# EAGLE design TransformerBox (EAGLE 9.7.0)
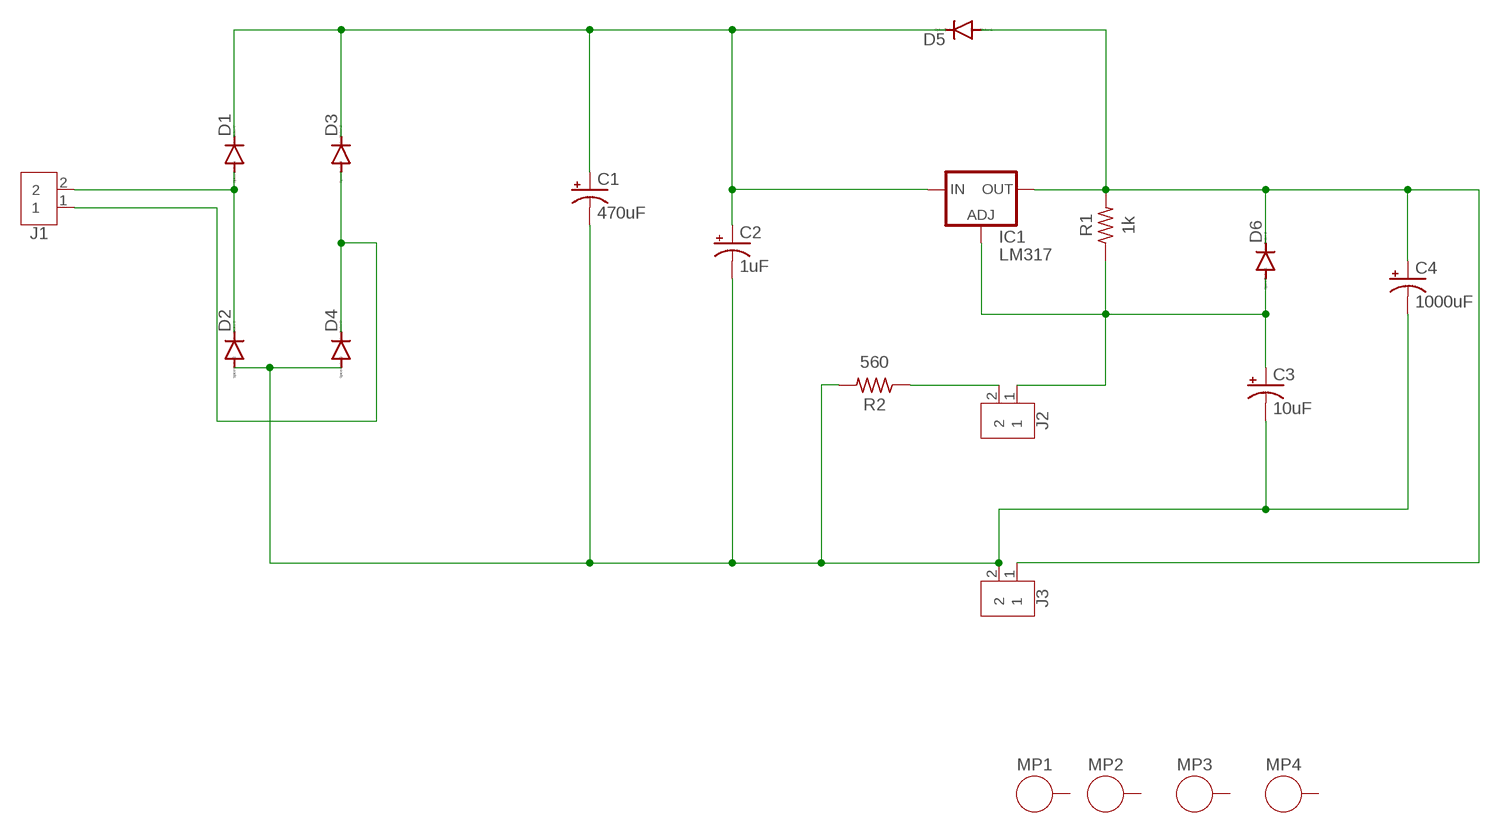
[diagram p0: schematic, sheet 1]

## Parts
C1  470uF  CAP-POL3.5MM  [E3,5-8]
C2  1uF  CAP-POL3.5MM  [E3,5-8]
C3  10uF  CAP-POL3.5MM  [E3,5-8]
C4  1000uF  CAP-POL3.5MM  [E3,5-8]
D1  DIODEDO35-10  [DO35-10]
D2  DIODEDO35-10  [DO35-10]
D3  DIODEDO35-10  [DO35-10]
D4  DIODEDO35-10  [DO35-10]
D5  DIODEDO35-10  [DO35-10]
D6  DIODEDO35-10  [DO35-10]
IC1  LM317  [TO220V]
J1  TERM-BLK-2P  TERMBLK_25.08MM  [TERMBLK_508-2N]
J2  TERM-BLK-2P  TERMBLK_25.08MM  [TERMBLK_508-2N]
J3  TERM-BLK-2P  TERMBLK_25.08MM  [TERMBLK_508-2N]
MP1  STANDOFF_M/F_M2_5MM  [STANDOFF_HEX_MALE-FEMALE_400X500_M2X0.4_MTGP600H220]
MP2  STANDOFF_M/F_M2_5MM  [STANDOFF_HEX_MALE-FEMALE_400X500_M2X0.4_MTGP600H220]
MP3  STANDOFF_M/F_M2_5MM  [STANDOFF_HEX_MALE-FEMALE_400X500_M2X0.4_MTGP600H220]
MP4  STANDOFF_M/F_M2_5MM  [STANDOFF_HEX_MALE-FEMALE_400X500_M2X0.4_MTGP600H220]
R1  1k  RESISTOR_AXIAL-11.7MM-PITCH  [RESAD1176W63L850D250B]
R2  560  RESISTOR_AXIAL-11.7MM-PITCH  [RESAD1176W63L850D250B]

## Nets
N$1: D1.A D2.C J1.2
N$2: D3.A D4.C J1.1
N$3: C1.- C2.- C3.- C4.- D2.A D4.A J3.2 R2.2
N$4: C1.+ C2.+ D1.C D3.C D5.C IC1.3(IN)
N$5: J2.2 R2.1
N$6: C4.+ D5.A D6.C IC1.2(OUT) J3.1 R1.2
N$7: C3.+ D6.A IC1.1(ADJ) J2.1 R1.1
Unconnected: MP1.1 MP2.1 MP3.1 MP4.1

## Library data of the parts
C1-C4 = SEMET 1:CAP-POL: POLARIZED CAPACITOR
D1-D6 = SEMET 1:DIODE: DIODE high speed (Philips)
IC1 = SEMET 1:LM317: VOLTAGE REGULATOR
J1-J3 = SEMET 1:TERMBLK_2: 2 Position Wire to Board Terminal Block Horizontal with Board Datasheet <https://www.te.com.cn/commerce/DocumentDelivery/DDEController?Action=showdoc&DocId=Catalog+Section%7F1308389_EUROSTYLE_TERMINAL_BLOCKS%7F0607%7Fpdf%7FEnglish%7FENG_CS_1308389_EUROSTYLE_TERMINAL_BLOCKS_0607.pdf%7F2-282837-5>; CATEGORY: Fixed Terminal Blocks; DESCRIPTION: Fixed Terminal Blocks 5.08MM PCB MOUNT 2P; MANUFACTURER: TE Connectivity AMP Connectors; MPN: 282837-2; OPERATING_TEMPERATURE: -40°C to +105°C; PART_STATUS: ACTIVE; PITCH: 0.200" (5.08mm); ROHS_COMPLIANCE: RoHS Compliant; SERIES: Buchanan; SUBCATEGORY: Terminal Blocks; TYPE: Through Hole; Screw - Rising Cage Clamp; Side wire entry, Horizontal with Board
MP1-MP4 = PCB-Fasteners_Hardware:STANDOFF_M/F: Male-Male Standoff/Spacer with Mounting pad and hole. Essentra : Male-Female Standoff <https://www.essentracomponents.co.in/index.php?option=com_virtuemart&view=productdetails&virtuemart_product_id=14556> The hole and pad sizes may vary based on the application and type of hardware; always verify the Manufacturer specification or Global Standards.; CATEGORY: Standoff/Spacer; DESCRIPTION: Hex Standoff Threaded M2 5 mm; HEIGHT: 5 mm; PACKAGE_SIZE: NA; PACKAGE_TYPE: NA; SUBCATEGORY: Male-Female; THREADED: Threaded; THREAD_SIZE: M2; TYPE: Hex Standoff
R1 R2 = SEMET 1:RESISTOR: Resistor Fixed - ANSI; CATEGORY: Resistor; SUB-CATEGORY: Fixed

## Board
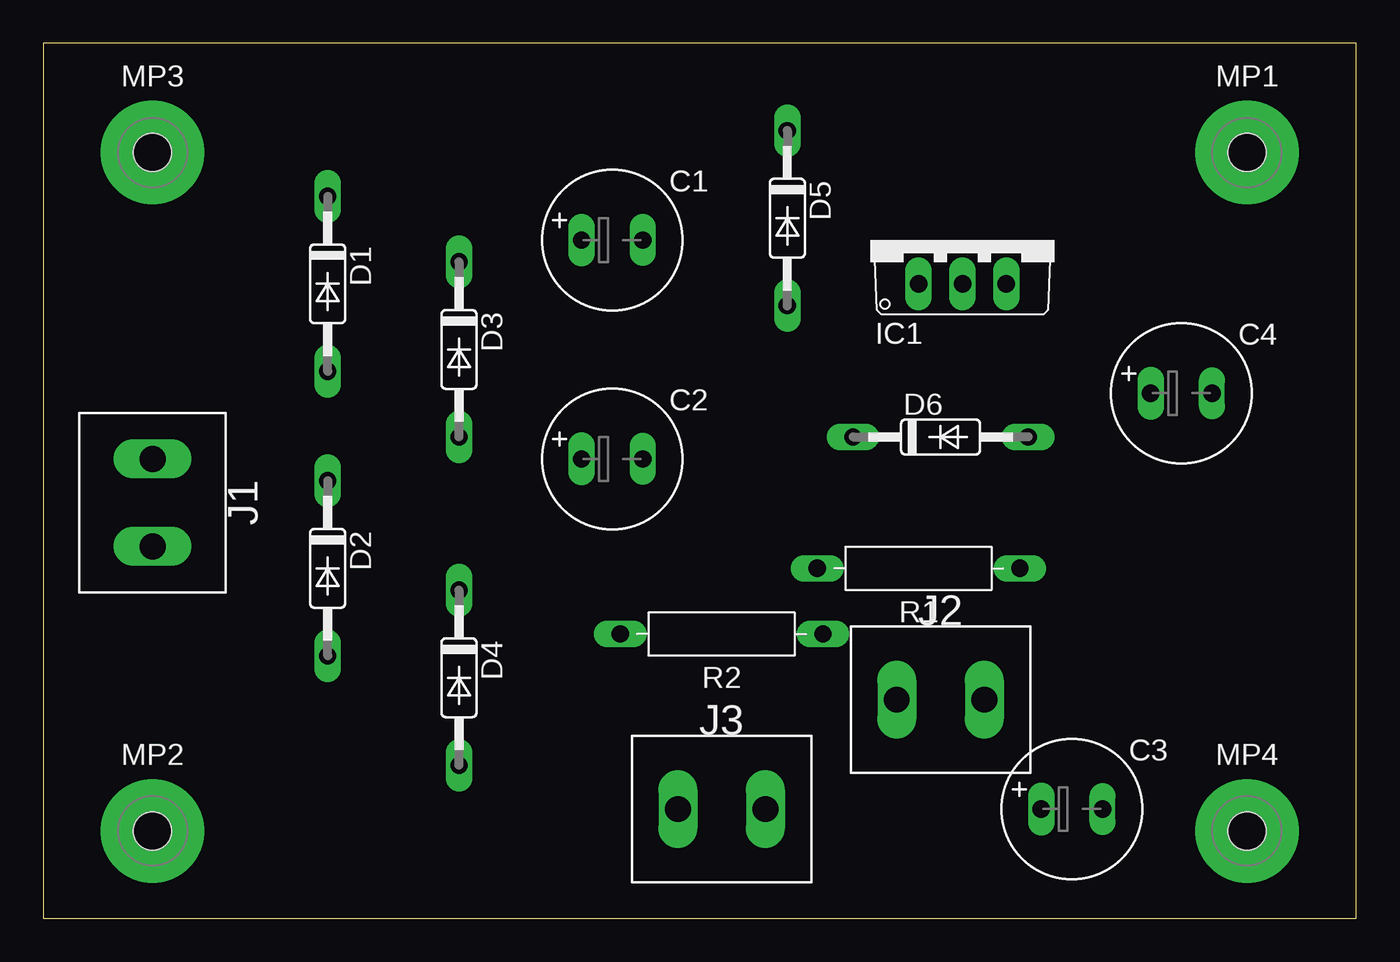
[diagram p1: board, top side]
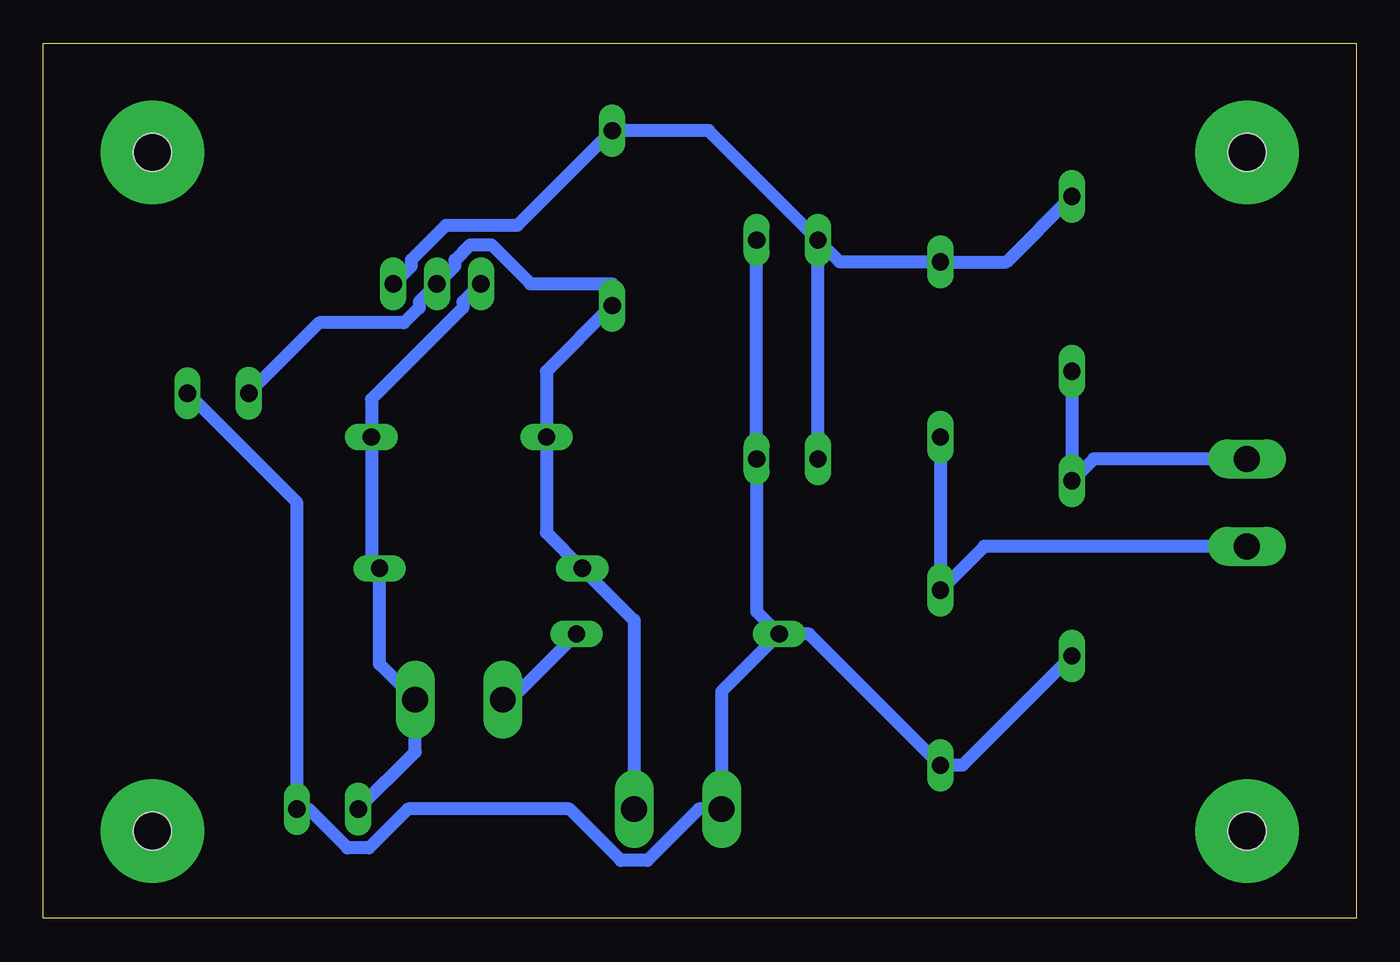
[diagram p2: board, bottom side, seen from below]

Size 76.2 x 50.8 mm. Coordinates in mm from the lower left corner, seen from the top.
Outline: 0,0 76.2,0 76.2,50.8 0,50.8 0,0
Copper layers (1*16): Top / Bottom
Stack-up Default Layer Stack: Top SilkScreen Epoxy Ink / Top SolderMask SR:Green 0.0254mm Dk 4.3 / Top Surface Finish Lead-Free 0.02mm / Top CuFoil:007 0.035mm / Dielectric-1 User Defined 1.5mm / Bottom CuFoil:007 0.035mm / Bottom Surface Finish Lead-Free 0.02mm / Bottom SolderMask SR:Green 0.0254mm Dk 4.3 / Bottom SilkScreen Epoxy Ink
Design rules: minimum copper width 18mil, minimum drill size 1mm, copper clearance wire_polygon to wire_polygon 14mil, copper clearance wire_polygon to pad_smd 14mil, copper clearance wire_polygon to via 14mil, copper clearance pad_smd to pad_smd 14mil, copper clearance pad_smd to via 14mil, copper clearance via to via 14mil, copper clearance smd to pad (same net) 14mil, copper clearance smd to via (same net) 14mil, copper clearance smd to smd (same net) 14mil, dimension clearance 40mil, restrict clearance 0mil, via restrict clearance 0mil, drill distance 6mil, keepout clearance 0mil

### Footprints (pad centres in the part's own frame; a part is rotated, then mirrored left to right if it is on the bottom)
E3,5-8 = drill 1 pad 1.524 long: + -1.778,0 | drill 1 pad 1.27 long: - 1.778,0
DO35-10 = drill 1 pad 1.524 long: A 5.08,0; C -5.08,0
TO220V = drill 1.016 pad 1.524 long: 1 -2.54,-2.54; 2 0,-2.54; 3 2.54,-2.54
TERMBLK_508-2N = drill 1.5 pad 2.184 long: 1 0,0; 2 5.08,0
STANDOFF_HEX_MALE-FEMALE_400X500_M2X0.4_MTGP600H220 = drill 2.2 pad 6: 1 0,0 | hole 2.2: 0,0
RESAD1176W63L850D250B = drill 1 pad 1.524 long: 1 -5.88,0; 2 5.88,0

### Placement (x,y rotation side)
C1  33.02,39.37 0 top
C2  33.02,26.67 0 top
C3  59.69,6.35 0 top
C4  66.04,30.48 0 top
D1  16.51,36.83 270 top
D2  16.51,20.32 270 top
D3  24.13,33.02 270 top
D4  24.13,13.97 270 top
D5  43.18,40.64 270 top
D6  52.07,27.94 0 top
IC1  53.34,39.37 0 top
J1  6.35,21.59 90 top
J2  54.61,12.7 180 top
J3  41.91,6.35 180 top
MP1  69.85,44.45 0 top
MP2  6.35,5.08 0 top
MP3  6.35,44.45 0 top
MP4  69.85,5.08 0 top
R1  50.8,20.32 180 top
R2  39.37,16.51 180 top

### Tracks (layer width: path | path; a pad name or v marks a point on that pad's centre or on a via)
N$1
  Bottom 0.762: J1.2 15.24,26.67 D2.C D1.A
N$2
  Bottom 0.762: J1.1 21.59,21.59 D4.C D3.A
N$3
  Bottom 0.762: D2.A 22.86,8.89 D4.A 31.75,16.51 R2.2 | C1.- C2.- 34.8,17.82 R2.2 | R2.2 36.83,13.17 J3.2 38.15,6.35 41.14,3.36 42.68,3.36 45.67,6.35 55.03,6.35 57.29,4.09 58.53,4.09 60.79,6.35 C3.- 61.47,24.13 C4.-
N$4
  Bottom 0.762: D1.C 20.32,38.1 D3.C 29.97,38.1 30.86,38.99 | 30.86,38.99 C1.+ 37.59,45.72 D5.C 48.69,40.21 52.84,40.21 54.84,38.21 54.84,37.87 IC1.3 | C2.+ 31.24,38.61 30.86,38.99
N$5
  Bottom 0.762: R2.1 49.06,12.7 J2.2
N$6
  Bottom 0.762: C4.+ 60.17,34.57 55.26,34.57 54.38,35.45 54.38,35.79 IC1.2 52.3,37.87 52.3,38.21 51.42,39.09 50.18,39.09 47.92,36.83 43.18,36.83 D5.A 46.99,31.75 D6.C 46.99,22.39 R1.2 41.91,17.31 J3.1
N$7
  Bottom 0.762: IC1.1 51.84,35.79 51.84,35.45 57.15,30.14 D6.A 57.15,20.79 R1.1 56.68,14.77 J2.1 54.61,9.65 C3.+